# Altium schematic sheet Base_SCH.SchDoc
size A; SheetNumber: 1; SheetTotal: 1
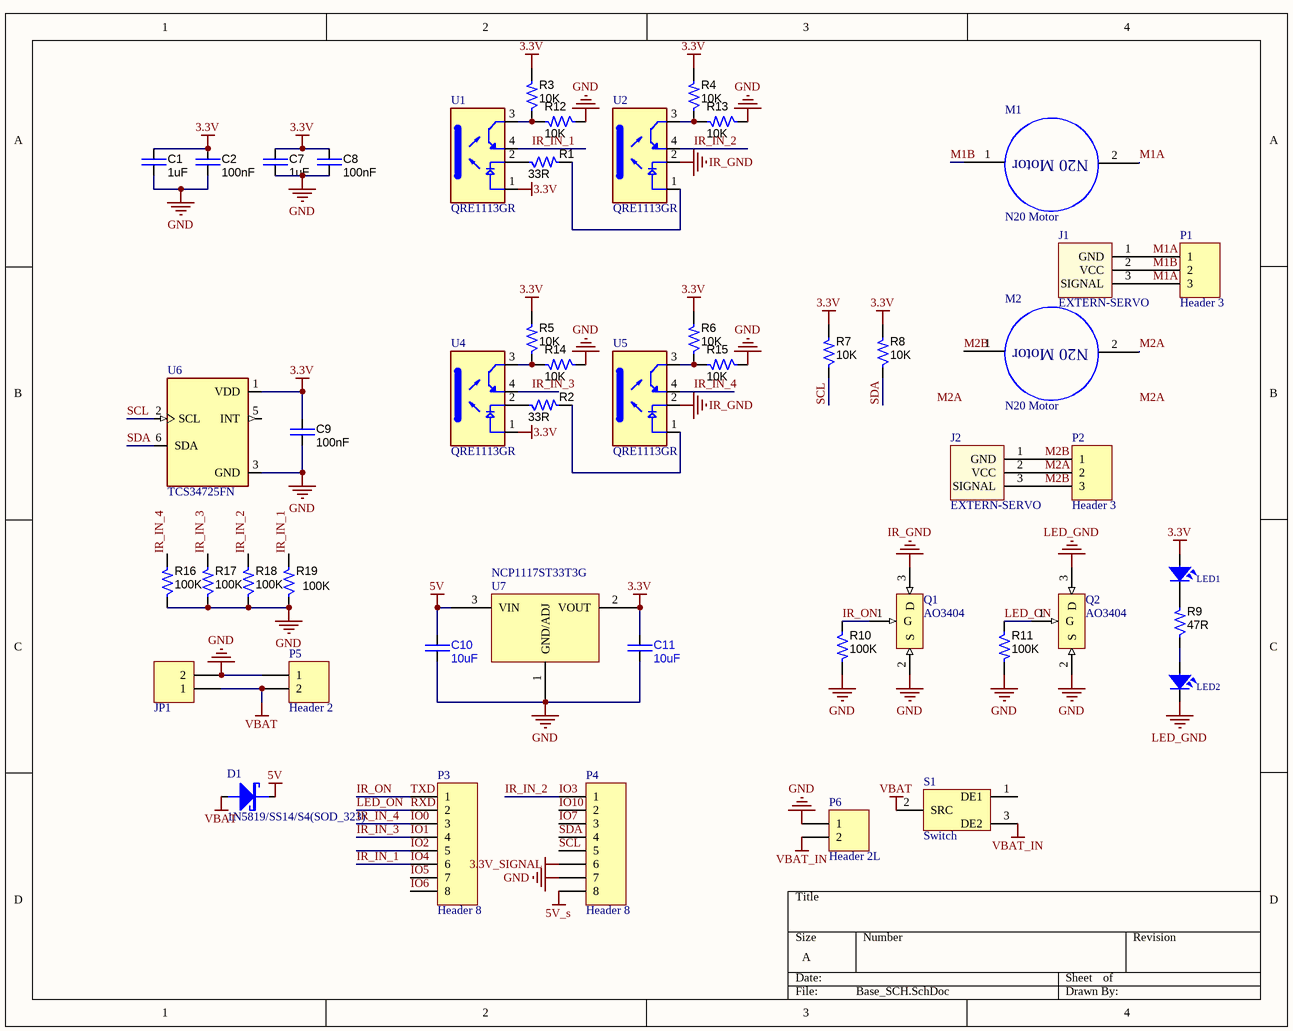
[diagram p0: Base_SCH.SchDoc]

## Parts
C1  1uF  [CAPC1608X90N]
C2  100nF  [CAPC1608X90N]
C7  1uF  [CAPC1608X90N]
C8  100nF  [CAPC1608X90N]
C9  100nF  [CAPC1608X90N]
C10  value 10uF  [CAPC2012X135N]  (hidden comment: approved sub OK)
C11  value 10uF  [CAPC2012X135N]  (hidden comment: approved sub OK)
D1  1N5819/SS14/S4(SOD_323)  [SMT_DIODE_SOD_323]
J1  EXTERN-SERVO  [JP3H]
J2  EXTERN-SERVO  [JP3H]
JP1  Header 2_1  [HED2]  (value not drawn)
LED1  LED SMD  [SM-LED-0805-Orange]  (value not drawn)
LED2  LED SMD  [SM-LED-0805-Orange]  (value not drawn)
M1  N20 Motor  [N20 motor no header]
M2  N20 Motor  [N20 motor no header]
P1  Header 3  [HDR1X3]
P2  Header 3  [HDR1X3]
P3  Header 8  [HDR1X8]
P4  Header 8  [HDR1X8]
P5  Header 2  [HDR1X2]
P6  Header 2L  [HDR1X2 - L]
Q1  AO3404  [SOT23-3]
Q2  AO3404  [SOT23-3]
R1  33R  [RESC1608N_ZERO]
R2  33R  [RESC1608N_ZERO]
R3  10K  [RESC1608N_ZERO]
R4  10K  [RESC1608N_ZERO]
R5  10K  [RESC1608N_ZERO]
R6  10K  [RESC1608N_ZERO]
R7  10K  [RESC1608N_ZERO]
R8  10K  [RESC1608N_ZERO]
R9  47R  [RESC1608N_ZERO]
R10  100K  [RESC1608N_ZERO]
R11  100K  [RESC1608N_ZERO]
R12  10K  [RESC1608N_ZERO]
R13  10K  [RESC1608N_ZERO]
R14  10K  [RESC1608N_ZERO]
R15  10K  [RESC1608N_ZERO]
R16  100K  [RESC1608N_ZERO]
R17  100K  [RESC1608N_ZERO]
R18  100K  [RESC1608N_ZERO]
R19  100K  [RESC1608N_ZERO]
S1  Switch  [Switch]
U1  QRE1113GR  [SOIC180P460X187-4N]
U2  QRE1113GR  [SOIC180P460X187-4N]
U4  QRE1113GR  [SOIC180P460X187-4N]
U5  QRE1113GR  [SOIC180P460X187-4N]
U6  TCS34725FN  [SON65P200X240X70-6N]
U7  NCP1117ST33T3G  [SOT-223 - duplicate]

## Nets
3.3V: C1.1 C2.1 C7.1 C8.1 C9.1 C11.1 LED1.1 R3.2 R4.2 R5.2 R6.2 R7.2 R8.2 U1.1(A) U4.1(A) U6.1(VDD) U7.2(VOUT)
3.3V_SIGNAL: P4.6
5V: C10.1 D1.2(K) U7.3(VIN)
5V_s: P4.8
GND: C1.2 C2.2 C7.2 C8.2 C9.2 C10.2 C11.2 JP1.2 P4.7 P5.1 P6.1 Q1.2(S) Q2.2(S) R10.2 R11.2 R12.1 R13.1 R14.1 R15.1 R16.1 R17.1 R18.1 R19.1 U6.3(GND) U7.1(GND/ADJ)
IR_GND: Q1.3(D) U2.2(C) U5.2(C)
LED_GND: LED2.2 Q2.3(D)
VBAT: D1.1(A) JP1.1 P5.2 S1.2(SRC)
VBAT_IN: P6.2 S1.3(DE2)
IO0: P3.3 R16.2 U5.4(ET)  [also labelled IR_IN_4]
IO1: P3.4 R17.2 U4.4(ET)  [also labelled IR_IN_3]
IO2: P3.5
IO3: P4.1 R18.2 U2.4(ET)  [also labelled IR_IN_2]
IO4: P3.6 R19.2 U1.4(ET)  [also labelled IR_IN_1]
IO5: P3.7
IO6: P3.8
IO7: P4.3
IO10: P4.2
IR_ON: P3.1 Q1.1(G) R10.1  [also labelled TXD]
LED_ON: P3.2 Q2.1(G) R11.1  [also labelled RXD]
M1A: J1.1(GND) J1.3(SIGNAL) M1.2 P1.1 P1.3
M1B: J1.2(VCC) M1.1 P1.2
M2A: J2.2(VCC) M2.2 P2.2
M2B: J2.1(GND) J2.3(SIGNAL) M2.1 P2.1 P2.3
SCL: P4.5 R7.1 U6.2(SCL)
SDA: P4.4 R8.1 U6.6(SDA)
NetLED1_2: LED1.2 R9.2
NetLED2_1: LED2.1 R9.1
NetR1_1: R1.1 U1.2(C)
NetR1_2: R1.2 U2.1(A)
NetR2_1: R2.1 U4.2(C)
NetR2_2: R2.2 U5.1(A)
NetR3_1: R3.1 R12.2 U1.3(CT)
NetR4_1: R4.1 R13.2 U2.3(CT)
NetR5_1: R5.1 R14.2 U4.3(CT)
NetR6_1: R6.1 R15.2 U5.3(CT)

Not connected (* = marked no-connect by the designer): S1 1(DE1) 4 5; U6 5(INT)

## Notes on the sheet
- Labels drawn without touching a wire or pin: M2A

## Library data of the parts
C1 C2 C7-C9 = CAP C_0603: Capacitor SMD Cer 470nF 10% 16V X7R 0603; Manufacturer 1: Murata Electronics North America; Manufacturer Part Number 1: GRM188R71C474KA88D; Ratings: 16V; X7R; Material: ceramic; SCDType: spec; Package / Case: 0603 (1608 metric); Tolerance: ±10%; Manufacturer 2: TDK Corporation; Manufacturer Part Number 2: C1608X7R1C474K; Supplier 1: Digi-Key; Supplier Part Number 1: 490-3295-2-ND; Supplier 2: Digi-Key; Supplier Part Number 2: 445-5192-2-ND; Supplier 3: Digi-Key; Supplier Part Number 3: 587-1250-2-ND; Manufacturer 3: Taiyo Yuden; Manufacturer Part Number 3: EMK107B7474KA-T; Manufacturer 4: Samsung; Manufacturer Part Number 4: CL10B474KONE; ComponentLink1URL: http://psearch.murata.com/capacitor/product/GRM188R71C474KA88#.pdf; ComponentLink1Description: http://psearch.murata.com/capacitor/product/GRM188R71C474KA88#.pdf; ComponentLink2URL: http://product.tdk.com/capacitor/mlcc/en/documents/mlcc_commercial_general_en.pdf; ComponentLink2Description: http://product.tdk.com/capacitor/mlcc/en/documents/mlcc_commercial_general_en.pdf; ComponentLink3URL: http://www.yuden.co.jp/or/product/category/capacitor/EMK107B7474KA-T.pdf; ComponentLink3Description: http://www.yuden.co.jp/or/product/category/capacitor/EMK107B7474KA-T.pdf
  C1 C7: Value: 1uF
  C2 C8 C9: Value: 100nF
C10 C11 = CAP C_0805: Capacitor SMD Cer 1.8nF 10% 50V X7R 0805; Manufacturer 1: AVX Corporation; Manufacturer Part Number 1: 08055C182KAT2A; Ratings: 50V; X7R; SCDType: source*; Tolerance: ±10%; Operating Temperature: -55°C ~ 125°C; Package / Case: 0805 (2012 metric); Supplier 1: Digi-Key; Supplier Part Number 1: 478-1374-1-ND
D1 = SMT_DIODE_SCHOTTKY_SOD_323: Surface mount schottky diode SOD-323(0805) Package
JP1 = Header 2_1: Header, 2-Pin; Manufacturer: Generic Components; Class: Connector; Value: Header 2
LED1 LED2 = LED SMD 0805
P1 P2 = Header 3: Header, 3-Pin; LatestRevisionDate: 17-Jul-2002; LatestRevisionNote: Re-released for DXP Platform.; Publisher: Altium Limited
P3 P4 = Header 8: Header, 8-Pin; LatestRevisionDate: 17-Jul-2002; LatestRevisionNote: Re-released for DXP Platform.; Publisher: Altium Limited
P5 = Header 2: Header, 2-Pin; LatestRevisionDate: 17-Jul-2002; LatestRevisionNote: Re-released for DXP Platform.; Publisher: Altium Limited
P6 = Header 2L: Header, 2-Pin; LatestRevisionDate: 17-Jul-2002; LatestRevisionNote: Re-released for DXP Platform.; Publisher: Altium Limited
R1-R19 = RES_0603: Resistor SMD chip 0.0 Ohm 0.1W 0603; Manufacturer 1: Vishay/Dale; Manufacturer Part Number 1: CRCW06030000Z0EA; Tolerance: ±5%; Ratings: 1/10W; SCDType: spec; Package / Case: 0603 (1608metric); Supplier 1: Digi-Key; Supplier Part Number 1: 541-0.0GCT-ND; ComponentLink1URL: http://www.vishay.com/doc?20035; ComponentLink1Description: http://www.vishay.com/doc?20035; Supplier 2: Digi-Key; Supplier Part Number 2: P0.0GTR-ND; Manufacturer 2: Panasonic Electronic Components; Manufacturer Part Number 2: ERJ-3GEY0R00V; RoHS 2: RoHS Compliant; ComponentLink2URL: http://industrial.panasonic.com/www-cgi/jvcr13pz.cgi?E+PZ+3+AOA0001+ERJ3GEY0R00V+7+WW; ComponentLink2Description: http://industrial.panasonic.com/www-cgi/jvcr13pz.cgi?E+PZ+3+AOA0001+ERJ3GEY0R00V+7+WW; Supplier 3: Digi-Key; Supplier Part Number 3: 311-0.0LECT-ND; Manufacturer 3: Yageo; Manufacturer Part Number 3: AC0603JR-070RL; RoHS 3: RoHS Compliant; ComponentLink3URL: http://www.yageo.com/documents/recent/PYu-AC_51_RoHS_L_2.pdf; ComponentLink3Description: http://www.yageo.com/documents/recent/PYu-AC_51_RoHS_L_2.pdf
U1 U2 U4 U5 = QRE1113GR: Reflective Optical Sensor 0.039 (1mm) 4-SMD, Gull Wing; MF: ON Semiconductor; Package: ARUSM-313-4 ON Semiconductor; Price: None; Check_prices: https://www.snapeda.com/parts/QRE1113GR/Onsemi/view-part/?ref=eda; Value: *; SnapEDA_Link: https://www.snapeda.com/parts/QRE1113GR/Onsemi/view-part/?ref=snap; MP: QRE1113GR; Availability: In Stock; Purchase-URL: https://pricing.snapeda.com/search/part/QRE1113GR/?ref=eda
U6 = TCS34725FN: ì»¬ëŸ¬ ì„¼ì„œ 16 b ê²Œì¸ ì œì–´, ì¸í„°ëŸ½íŠ¸, ì ˆì „ ëª¨ë“œ 6-SMD ëª¨ë“ˆ; MF: ams; Price: None; Availability: In Stock; Package: SMD-6 ams; MP: TCS34725FN; Value: *; SnapEDA_Link: https://www.snapeda.com/parts/TCS34725FN/ams/view-part/?ref=snap; Purchase-URL: https://pricing.snapeda.com/search/part/TCS34725FN/?ref=eda; Check_prices: https://www.snapeda.com/parts/TCS34725FN/ams/view-part/?ref=eda
U7 = NCP1117: NCP1117, NCV1117. 1.0 A Low-Dropout Positive  Fixed and Adjustable  Voltage Regulators